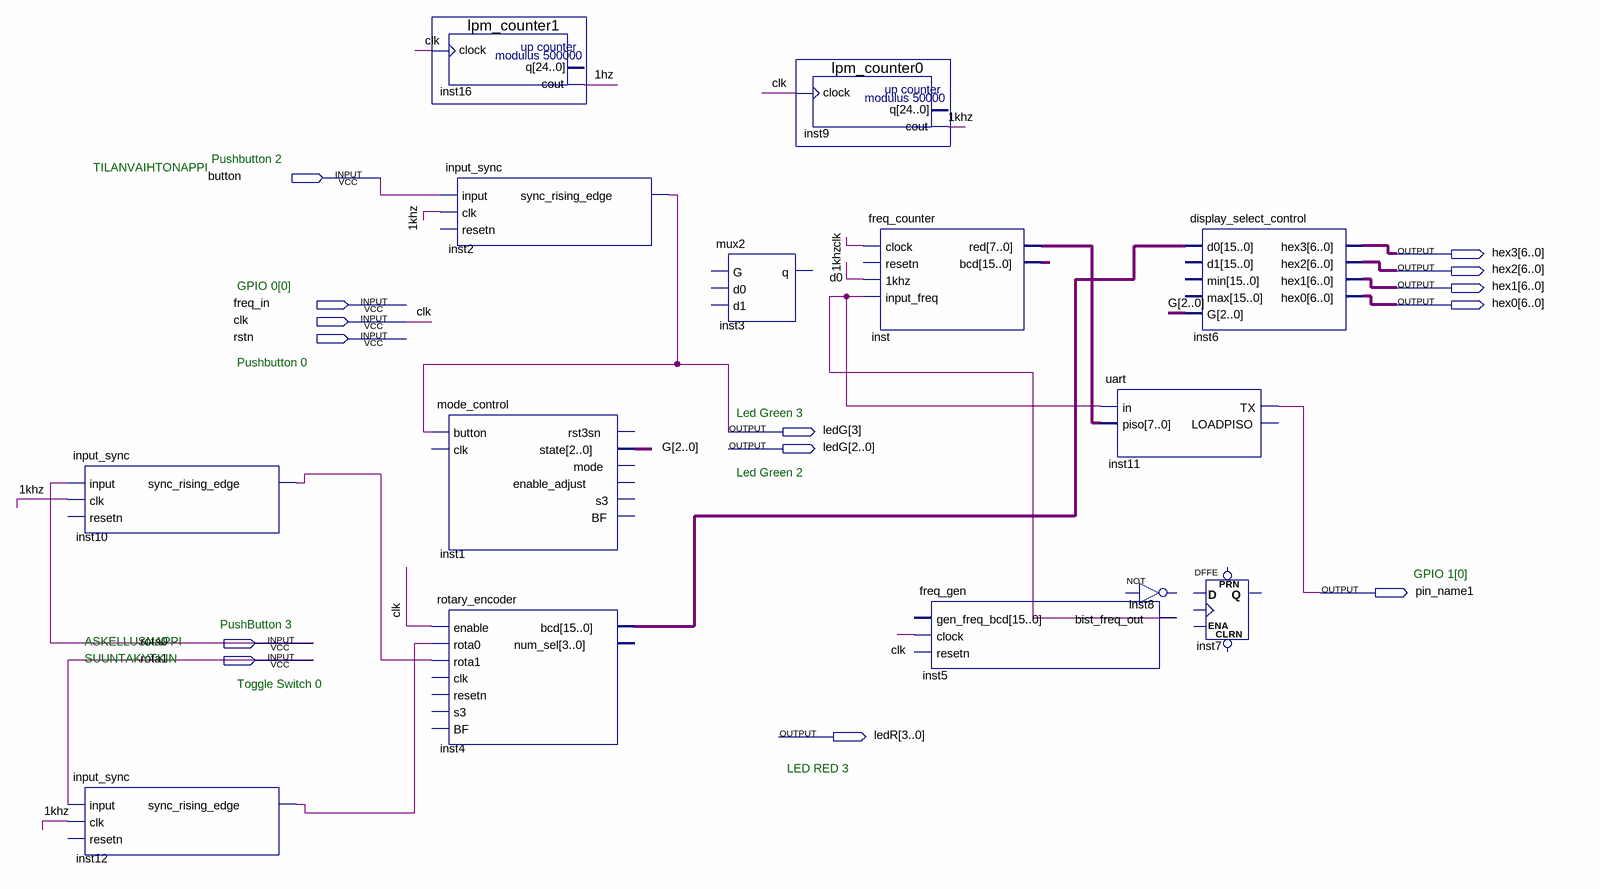
[diagram p0: schematic sheet]
// Quartus schematic harkka2018.bdf as structural Verilog: 14 symbols, 14 pins
module harkka2018 (
  input  button,
  input  freq_in,
  input  clk,
  input  rstn,
  input  rota0,
  input  rota1,
  output [6:0] hex3,
  output [6:0] hex2,
  output [6:0] hex1,
  output [6:0] hex0,
  output [3:0] ledG,
  output pin_name1,
  output [3:0] ledR
);

  wire \1hz , \1khz , d0, inst10_sync_rising_edge, inst12_sync_rising_edge;
  wire [2:0] G;
  wire [7:0] inst_red;
  wire [15:0] inst4_bcd, inst_bcd;

  input_sync inst10 (.\input (rota0), .clk(\1khz ), .sync_rising_edge(inst10_sync_rising_edge));  // open: resetn
  input_sync inst12 (.\input (rota1), .clk(\1khz ), .sync_rising_edge(inst12_sync_rising_edge));  // open: resetn
  lpm_counter1 inst16 (.clock(clk), .cout(\1hz ));  // open: q
  input_sync inst2 (.\input (button), .clk(\1khz ), .sync_rising_edge(ledG[3]));  // open: resetn
  mode_control inst1 (.button(ledG[3]), .state(G));  // open: clk, rst3sn, mode, enable_adjust, s3, BF
  rotary_encoder inst4 (
    .enable(clk), .rota0(inst12_sync_rising_edge), .rota1(inst10_sync_rising_edge), .bcd(inst4_bcd));  // open: clk, resetn, s3, BF, num_sel
  mux2 inst3 ();  // open: G, d0, d1, q
  lpm_counter0 inst9 (.clock(clk), .cout(\1khz ));  // open: q
  freq_counter inst (.clock(clk), .\1khz (\1khz ), .input_freq(d0), .red(inst_red), .bcd(inst_bcd));  // open: resetn
  freq_gen inst5 (.clock(clk), .bist_freq_out(d0));  // open: gen_freq_bcd, resetn
  uart inst11 (.in(d0), .piso(inst_red), .TX(pin_name1));  // open: LOADPISO
  // NOT inst8 is placed but not wired
  display_select_control inst6 (
    .d0(inst4_bcd), .G(G), .hex3(hex3), .hex2(hex2), .hex1(hex1), .hex0(hex0));  // open: d1, min, max
  DFFE inst7 ();  // open: PRN, CLRN, D, CLK, ENA, Q

  // Notes on the sheet:
  //   Pushbutton 2
  //   TILANVAIHTONAPPI
  //   GPIO 0[0]
  //   Pushbutton 0
  //   Led Green 3
  //   Led Green 2
  //   GPIO 1[0]
  //   PushButton 3
  //   ASKELLUSNAPPI
  //   SUUNTAKYTKIN
  //   Toggle Switch 0
  //   LED RED 3
endmodule
